# Altium project RL_2_Mini_V1.0.3.PrjPCB
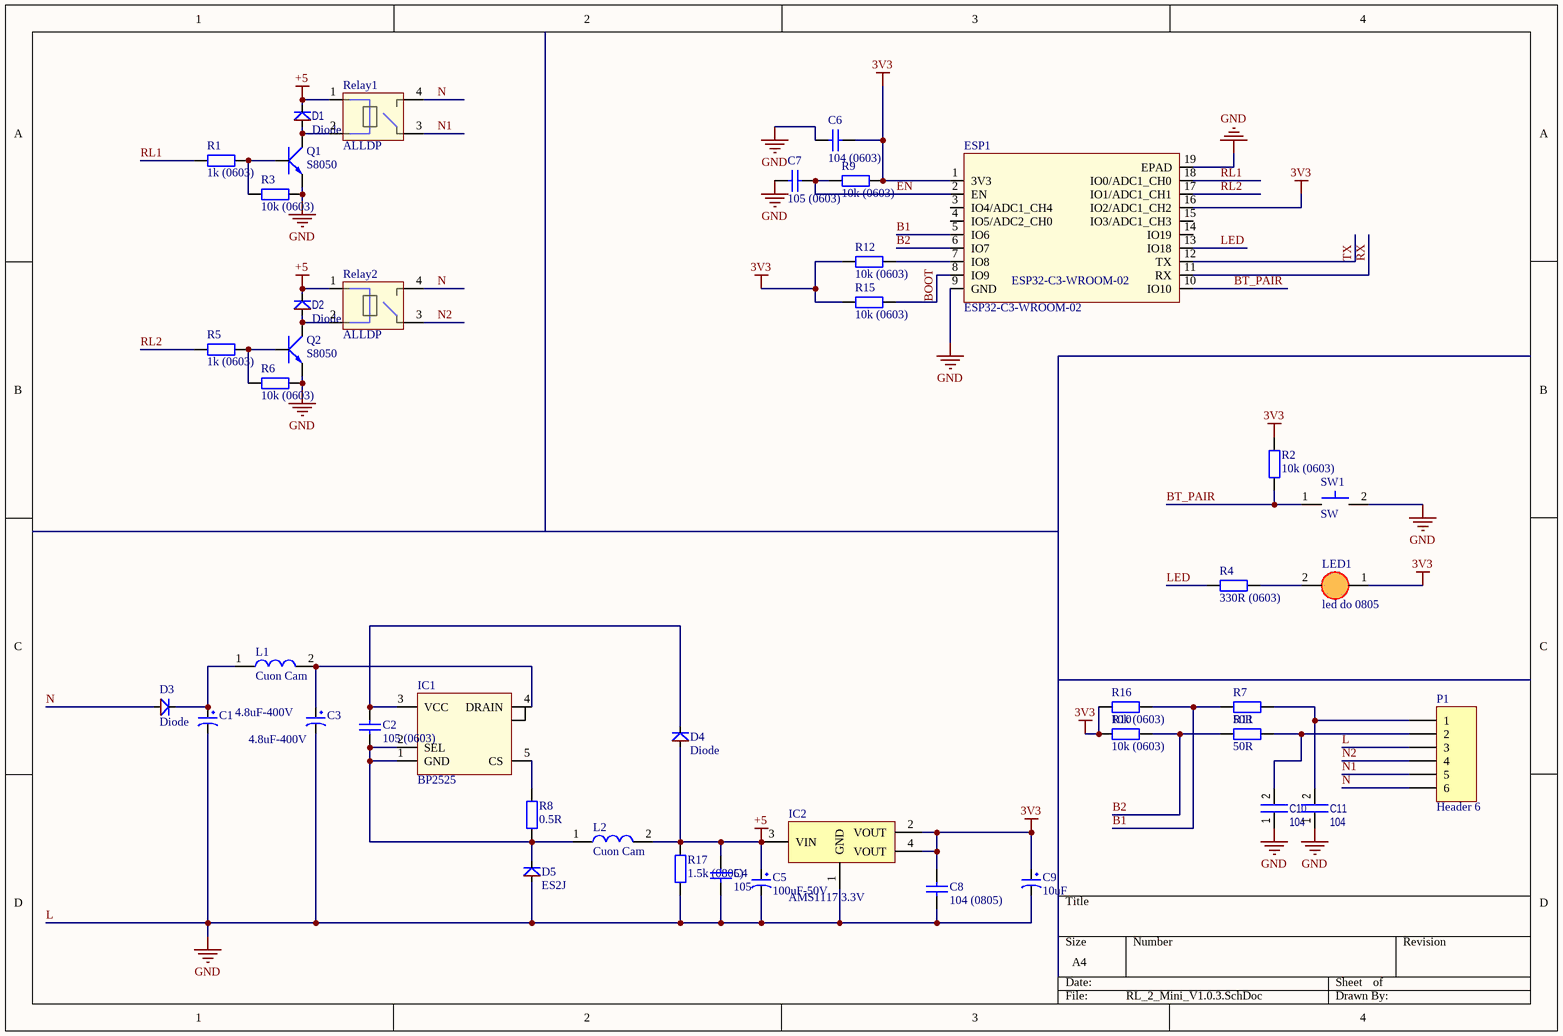
[diagram p0: RL_2_Mini_V1.0.3.SchDoc]
1 sheet, 43 parts. Net scope: global (net labels, ports and power ports of the same name join across sheets).
Board file: RL_2_Mini_V10.3.PcbDoc

## Sheet RL_2_Mini_V1.0.3.SchDoc
size A4

### Parts
C1  4.8uF-400V  [tu hoa 8mm]
C2  105 (0603)  [tu 0603]
C3  4.8uF-400V  [tu hoa 8mm]
C4  105  [tu 0805]
C5  100uF-50V  [tu hoa 8mm]
C6  104 (0603)  [tu 0603]
C7  105 (0603)  [tu 0603]
C8  104 (0805)  [tu 0805]
C9  10uF  [tu tantalum smd3216]
C10  104  [CAP 0603]
C11  104  [CAP 0603]
D1  Diode  [SOD-123]
D2  Diode  [SOD-123]
D3  Diode  [SMA]
D4  Diode  [SMA]
D5  ES2J  [SMA]
ESP1  ESP32-C3-WROOM-02  [ESP32-C3-WROOM 02U]
IC1  BP2525  [SOT23-5]
IC2  AMS1117 3.3V  [SOT223]
L1  Cuon Cam  [0510 - H]
L2  Cuon Cam  [PRS8040 - HALF]
LED1  led do 0805  [led 0805]
P1  Header 6  [KF127-3P]
Q1  S8050  [SOT23B]
Q2  S8050  [SOT23B]
R1  1k (0603)  [tro 0603]
R2  10k (0603)  [tro 0603]
R3  10k (0603)  [tro 0603]
R4  330R (0603)  [tro 0603]
R5  1k (0603)  [tro 0603]
R6  10k (0603)  [tro 0603]
R7  50R  [tro 0603]
R8  0.5R  [TRO 1206]
R9  10k (0603)  [tro 0603]
R10  10k (0603)  [tro 0603]
R11  50R  [tro 0603]
R12  10k (0603)  [tro 0603]
R15  10k (0603)  [tro 0603]
R16  10k (0603)  [tro 0603]
R17  1.5k (0805)  [tro 0805]
Relay1  ALLDP  [H32F]
Relay2  ALLDP  [H32F]
SW1  SW  [SW 3x4mm SMD]

### Nets
3V3: C6.1 C8.1 C9.1 ESP1.1(3V3) ESP1.16(IO2/ADC1_CH2) IC2.2(VOUT) IC2.4(VOUT) LED1.1(A) R2.2 R9.2 R10.1 R12.1 R15.1 R16.1
+5: C4.1 C5.1 D1.2(K) D2.2(K) D4.1(A) IC2.3(VIN) L2.2 R17.2 Relay1.1 Relay2.1
L: C1.2 C3.2 C4.2 C5.2 C6.2 C7.2 C8.2 C9.2 C10.1 C11.1 D5.1(A) ESP1.9(GND) ESP1.19(EPAD) IC2.1(GND) P1.3 Q1.2(E) Q2.2(E) R3.2 R6.2 R17.1 SW1.2  [also labelled GND]
B1: ESP1.5(IO6) R7.1 R16.2
B2: ESP1.6(IO7) R10.2 R11.1
BOOT: ESP1.8(IO9) R15.2
BT_PAIR: ESP1.10(IO10) R2.1 SW1.1
EN: C7.1 ESP1.2(EN) R9.1
LED: ESP1.13(IO18) R4.1
N: D3.1(A) P1.6 Relay1.4 Relay2.4
N1: P1.5 Relay1.3
N2: P1.4 Relay2.3
RL1: ESP1.18(IO0/ADC1_CH0) R1.1
RL2: ESP1.17(IO1/ADC1_CH1) R5.1
RX: ESP1.11(RX)
TX: ESP1.12(TX)
NetC1_1: C1.1 D3.2(K) L1.1
NetC2_1: C2.1 D4.2(K) IC1.3(VCC)
NetC2_2: C2.2 D5.2(K) IC1.1(GND) IC1.2(SEL) L2.1 R8.1
NetC3_1: C3.1 IC1.4(DRAIN) L1.2
NetC10_2: C10.2 P1.2 R11.2
NetC11_2: C11.2 P1.1 R7.2
NetD1_1: D1.1(A) Q1.3(C) Relay1.2
NetD2_1: D2.1(A) Q2.3(C) Relay2.2
NetESP1_7: ESP1.7(IO8) R12.2
NetIC1_5: IC1.5(CS) R8.2
NetLED1_2: LED1.2(K) R4.2
NetQ1_1: Q1.1(B) R1.2 R3.1
NetQ2_1: Q2.1(B) R5.2 R6.1

Not connected (* = marked no-connect by the designer): ESP1 3(IO4/ADC1_CH4) 4(IO5/ADC2_CH0) 14(IO19) 15(IO3/ADC1_CH3)

### Library data of the parts
C1 C3 = Tu Hoa 2.2uF 400V 8x12: Cắm; Don_Vi: Con; So_Chan: 2; Ten_Linh_Kien: Tụ Hóa 2.2uF 400V 8x12MM; Ma_Hang: MH003743; Chung_Loai: Cắm; Kieu_Chan: *
C2 C7 = Tu 0603 105 16V 20%: Dán; Don_Vi: Con; So_Chan: 2; Ten_Linh_Kien: Tụ 0603 105-1uF 20% 16V; Ma_Hang: MH004574; Chung_Loai: Dán; Kieu_Chan: *
C4 C8 = Tu 0805 104 50V 10%: Dán; Don_Vi: Con; So_Chan: 2; Ten_Linh_Kien: Tụ 0805 104-100nF 10% 50V; Ma_Hang: MH004551; Chung_Loai: Dán; Kieu_Chan: *
C5 = Tu Hoa 100uF 50V 8x11: Cắm; Don_Vi: Con; So_Chan: 2; Ten_Linh_Kien: Tụ Hóa 100uF 50V 8x11MM; Ma_Hang: MH006872; Chung_Loai: Cắm; Kieu_Chan: *
C6 = Tu 0603 104 50V 10%: Dán; Don_Vi: Con; So_Chan: 2; Ten_Linh_Kien: Tụ 0603 104-100nF 10% 50V; Ma_Hang: MH004568; Chung_Loai: Dán; Kieu_Chan: *
C9 = Tu tantalum 10uF 16V SMD3216: Dán; Don_Vi: Con; So_Chan: 2; Ten_Linh_Kien: Tụ tantalum 106C-10uF 16V SMD3216; Ma_Hang: MH001954; Chung_Loai: Dán; Kieu_Chan: *
C10 C11 = Tu Ceramic
D5 = Diode
IC2 = AMS1117 3.3V: Dán; Ten_Linh_Kien: AMS1117-3.3V SOT223; Don_Vi: Con; So_Chan: 4; Ma_Hang: MH000596; Kieu_Chan: SOT223; Chung_Loai: Dán
LED1 = Led 0805 Do: Dán; Don_Vi: Con; So_Chan: 2; Ten_Linh_Kien: LED 0805 Màu Đỏ; Ma_Hang: MH000897; Chung_Loai: Dán; Kieu_Chan: *
P1 = Header 6: Header, 6-Pin; LatestRevisionDate: 17-Jul-2002; LatestRevisionNote: Re-released for DXP Platform.; Publisher: Altium Limited
Q1 Q2 = S8050: Dán; Don_Vi: Con; Ten_Linh_Kien: S8050 SOT23 Trans NPN 0.5A 40V (J3Y); Ma_Hang: MH004708; Chung_Loai: Dán
R1 R5 = Tro 0603 5% 1k: Dán; Don_Vi: Con; So_Chan: 2; Ten_Linh_Kien: Trở 0603 5% 1k; Ma_Hang: MH006319; Chung_Loai: Dán; Kieu_Chan: *
R2 R3 R6 R7 R9-R12 R15 R16 = Tro 0603 5% 10k: Dán; Don_Vi: Con; So_Chan: 2; Ten_Linh_Kien: Trở 0603 5% 10k; Ma_Hang: MH006316; Chung_Loai: Dán; Kieu_Chan: *
R4 = Tro 0603 5% 330R: Dán; Don_Vi: Con; Ma_Hang: MH006910; So_Chan: 2; Ten_Linh_Kien: Trở 0603 5% 330R; Chung_Loai: Dán; Kieu_Chan: *
R8 = Tro 1206 5% 0R: Dán; Don_Vi: Con; So_Chan: 2; Ten_Linh_Kien: Trở 1206 5% 0R; Ma_Hang: MH005902; Chung_Loai: Dán; Kieu_Chan: *
R17 = Tro 0805 5% 1.5k: Dán; Don_Vi: Con; So_Chan: 2; Ten_Linh_Kien: Trở 0805 5% 1.5k; Ma_Hang: MH005232; Chung_Loai: Dán; Kieu_Chan: *
Relay1 Relay2 = Relay 4 Chan
SW1 = Nut Nhan 2 chan